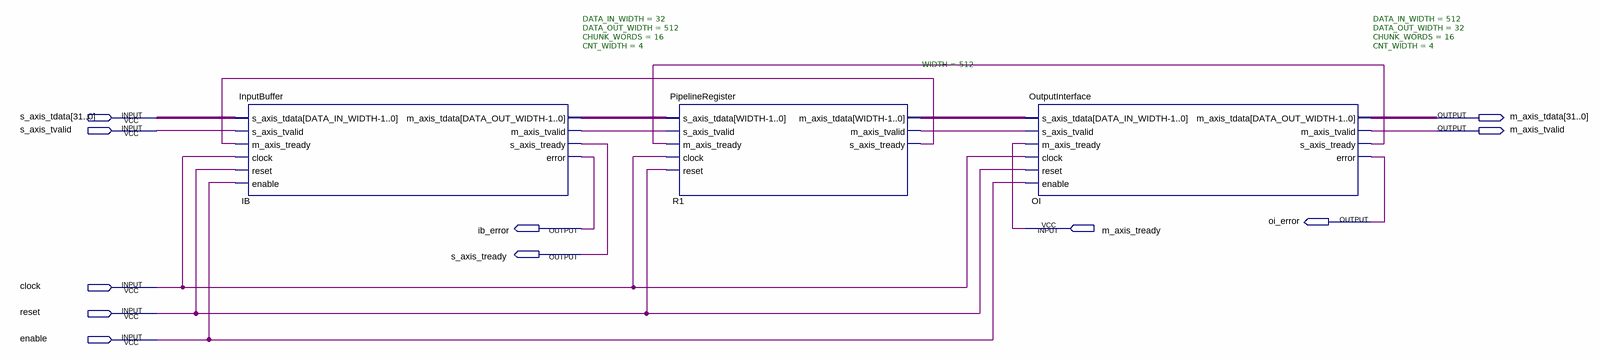
[diagram p0: schematic sheet]
// Quartus schematic PrivacyAmplification.bdf as structural Verilog: 3 symbols, 11 pins
module PrivacyAmplification (
  input  [31:0] s_axis_tdata,
  input  s_axis_tvalid,
  input  m_axis_tready,
  input  clock,
  input  reset,
  input  enable,
  output [31:0] m_axis_tdata,
  output m_axis_tvalid,
  output oi_error,
  output ib_error,
  output s_axis_tready
);

  wire IB_m_axis_tvalid, OI_s_axis_tready, R1_m_axis_tvalid, R1_s_axis_tready;
  wire [511:0] IB_m_axis_tdata, R1_m_axis_tdata;

  InputBuffer #(.DATA_IN_WIDTH(32), .DATA_OUT_WIDTH(512), .CHUNK_WORDS(16), .CNT_WIDTH(4)) IB (
    .s_axis_tdata(s_axis_tdata), .s_axis_tvalid(s_axis_tvalid), .m_axis_tready(R1_s_axis_tready),
    .clock(clock), .reset(reset), .enable(enable), .m_axis_tdata(IB_m_axis_tdata),
    .m_axis_tvalid(IB_m_axis_tvalid), .s_axis_tready(s_axis_tready), .error(ib_error));
  PipelineRegister #(.WIDTH(512)) R1 (
    .s_axis_tdata(IB_m_axis_tdata), .s_axis_tvalid(IB_m_axis_tvalid), .m_axis_tready(OI_s_axis_tready),
    .clock(clock), .reset(reset), .m_axis_tdata(R1_m_axis_tdata), .m_axis_tvalid(R1_m_axis_tvalid),
    .s_axis_tready(R1_s_axis_tready));
  OutputInterface #(.DATA_IN_WIDTH(512), .DATA_OUT_WIDTH(32), .CHUNK_WORDS(16), .CNT_WIDTH(4)) OI (
    .s_axis_tdata(R1_m_axis_tdata), .s_axis_tvalid(R1_m_axis_tvalid), .m_axis_tready(m_axis_tready),
    .clock(clock), .reset(reset), .enable(enable), .m_axis_tdata(m_axis_tdata),
    .m_axis_tvalid(m_axis_tvalid), .s_axis_tready(OI_s_axis_tready), .error(oi_error));
endmodule
